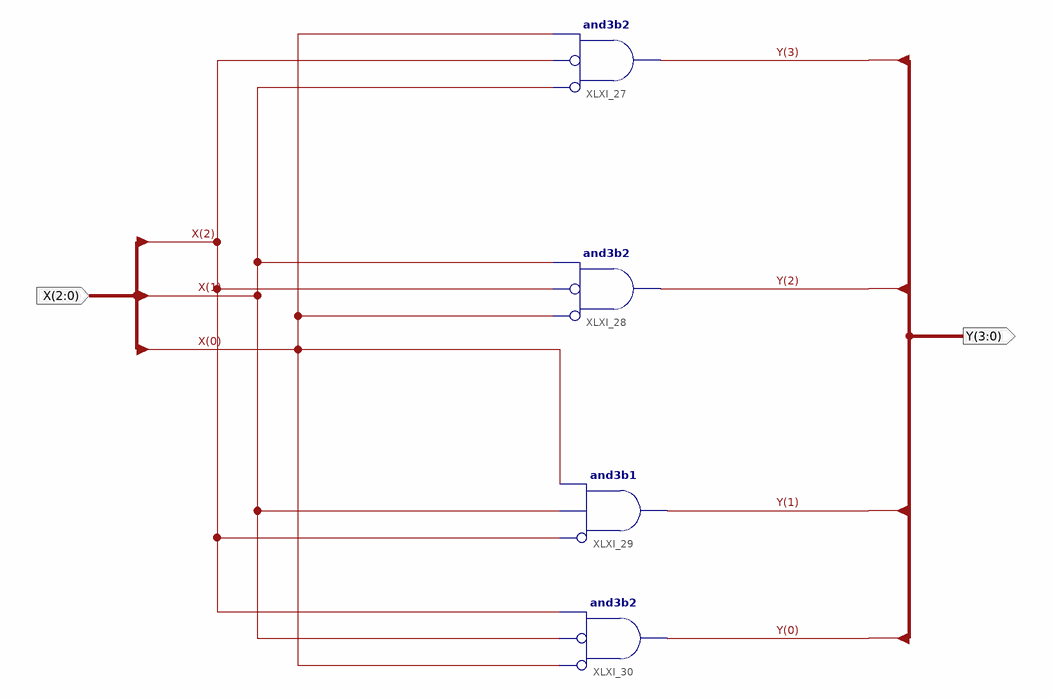
[diagram p0: schematic sheet 1]
// Xilinx ISE schematic decoder3to4.sch (spartan6) as structural Verilog: 4 symbols, 2 ports
module decoder3to4 (
  input  [2:0] X,
  output [3:0] Y
);

  and XLXI_27 (Y[3], ~X[1], ~X[2], X[0]);  // and3b2
  and XLXI_28 (Y[2], ~X[0], ~X[2], X[1]);  // and3b2
  and XLXI_29 (Y[1], ~X[2], X[1], X[0]);  // and3b1
  and XLXI_30 (Y[0], ~X[0], ~X[1], X[2]);  // and3b2
endmodule
